# EAGLE design beacon1 (EAGLE 9.2.2)
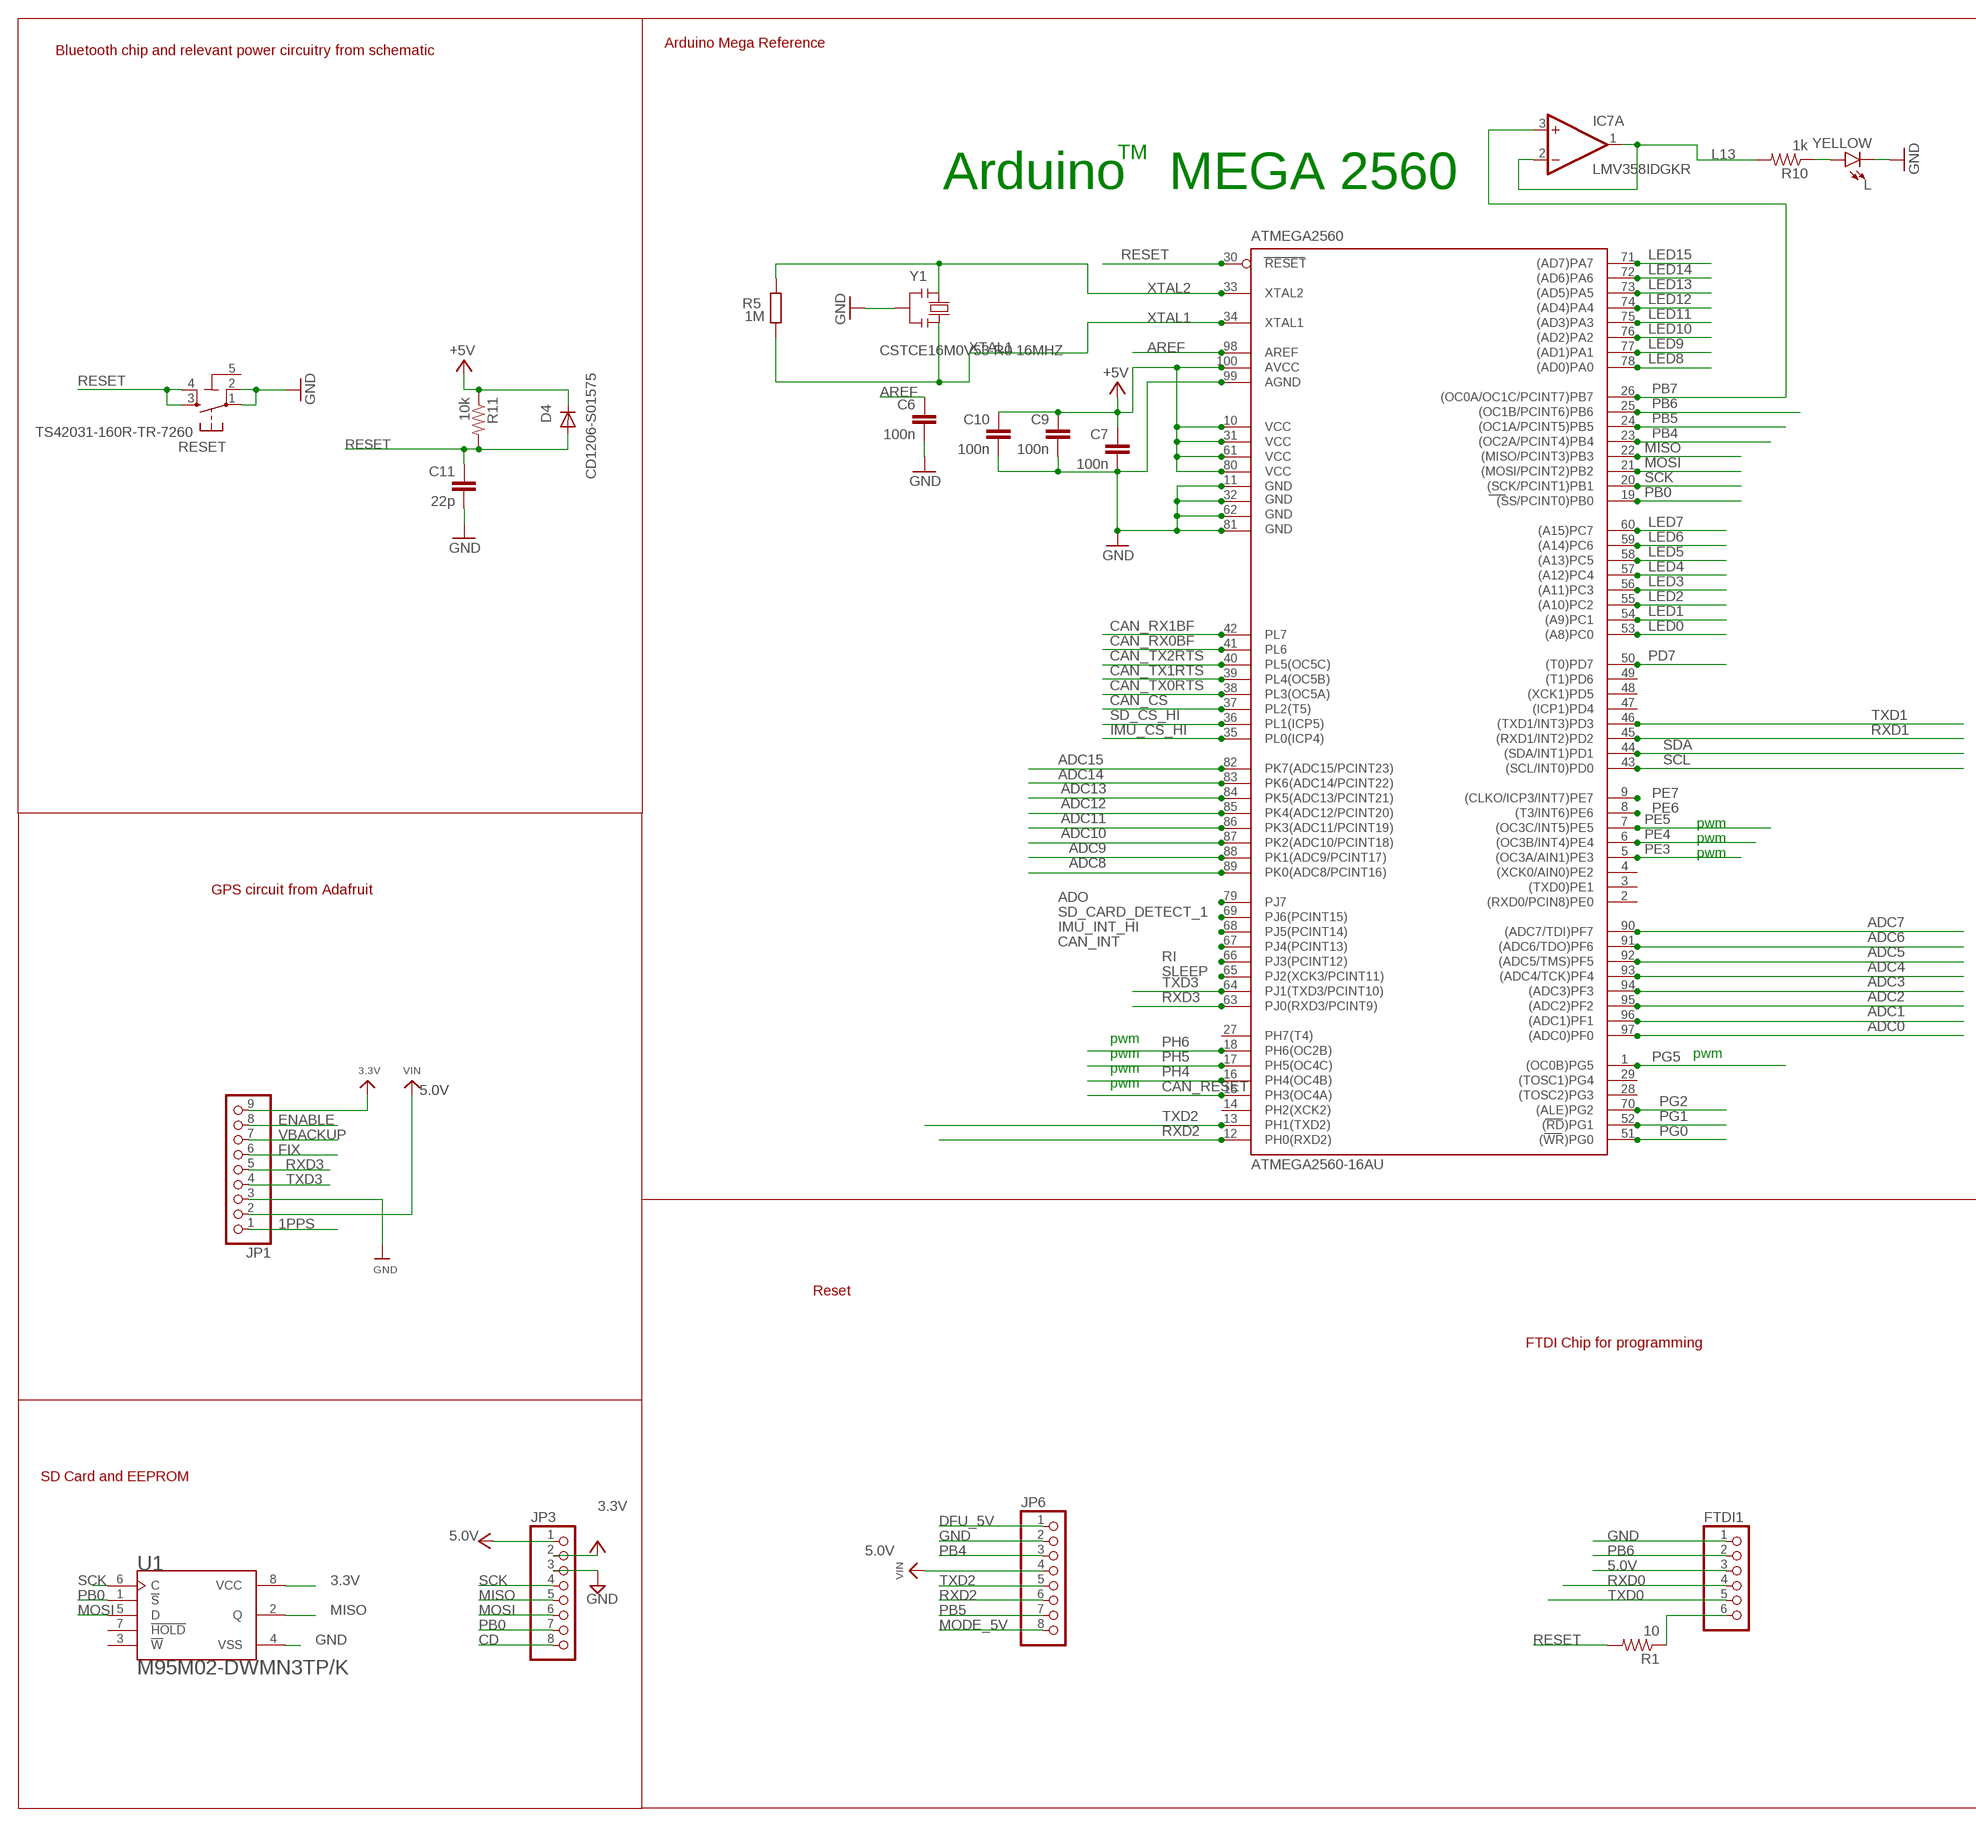
[diagram p0: schematic, sheet 1, part 1 of 2]
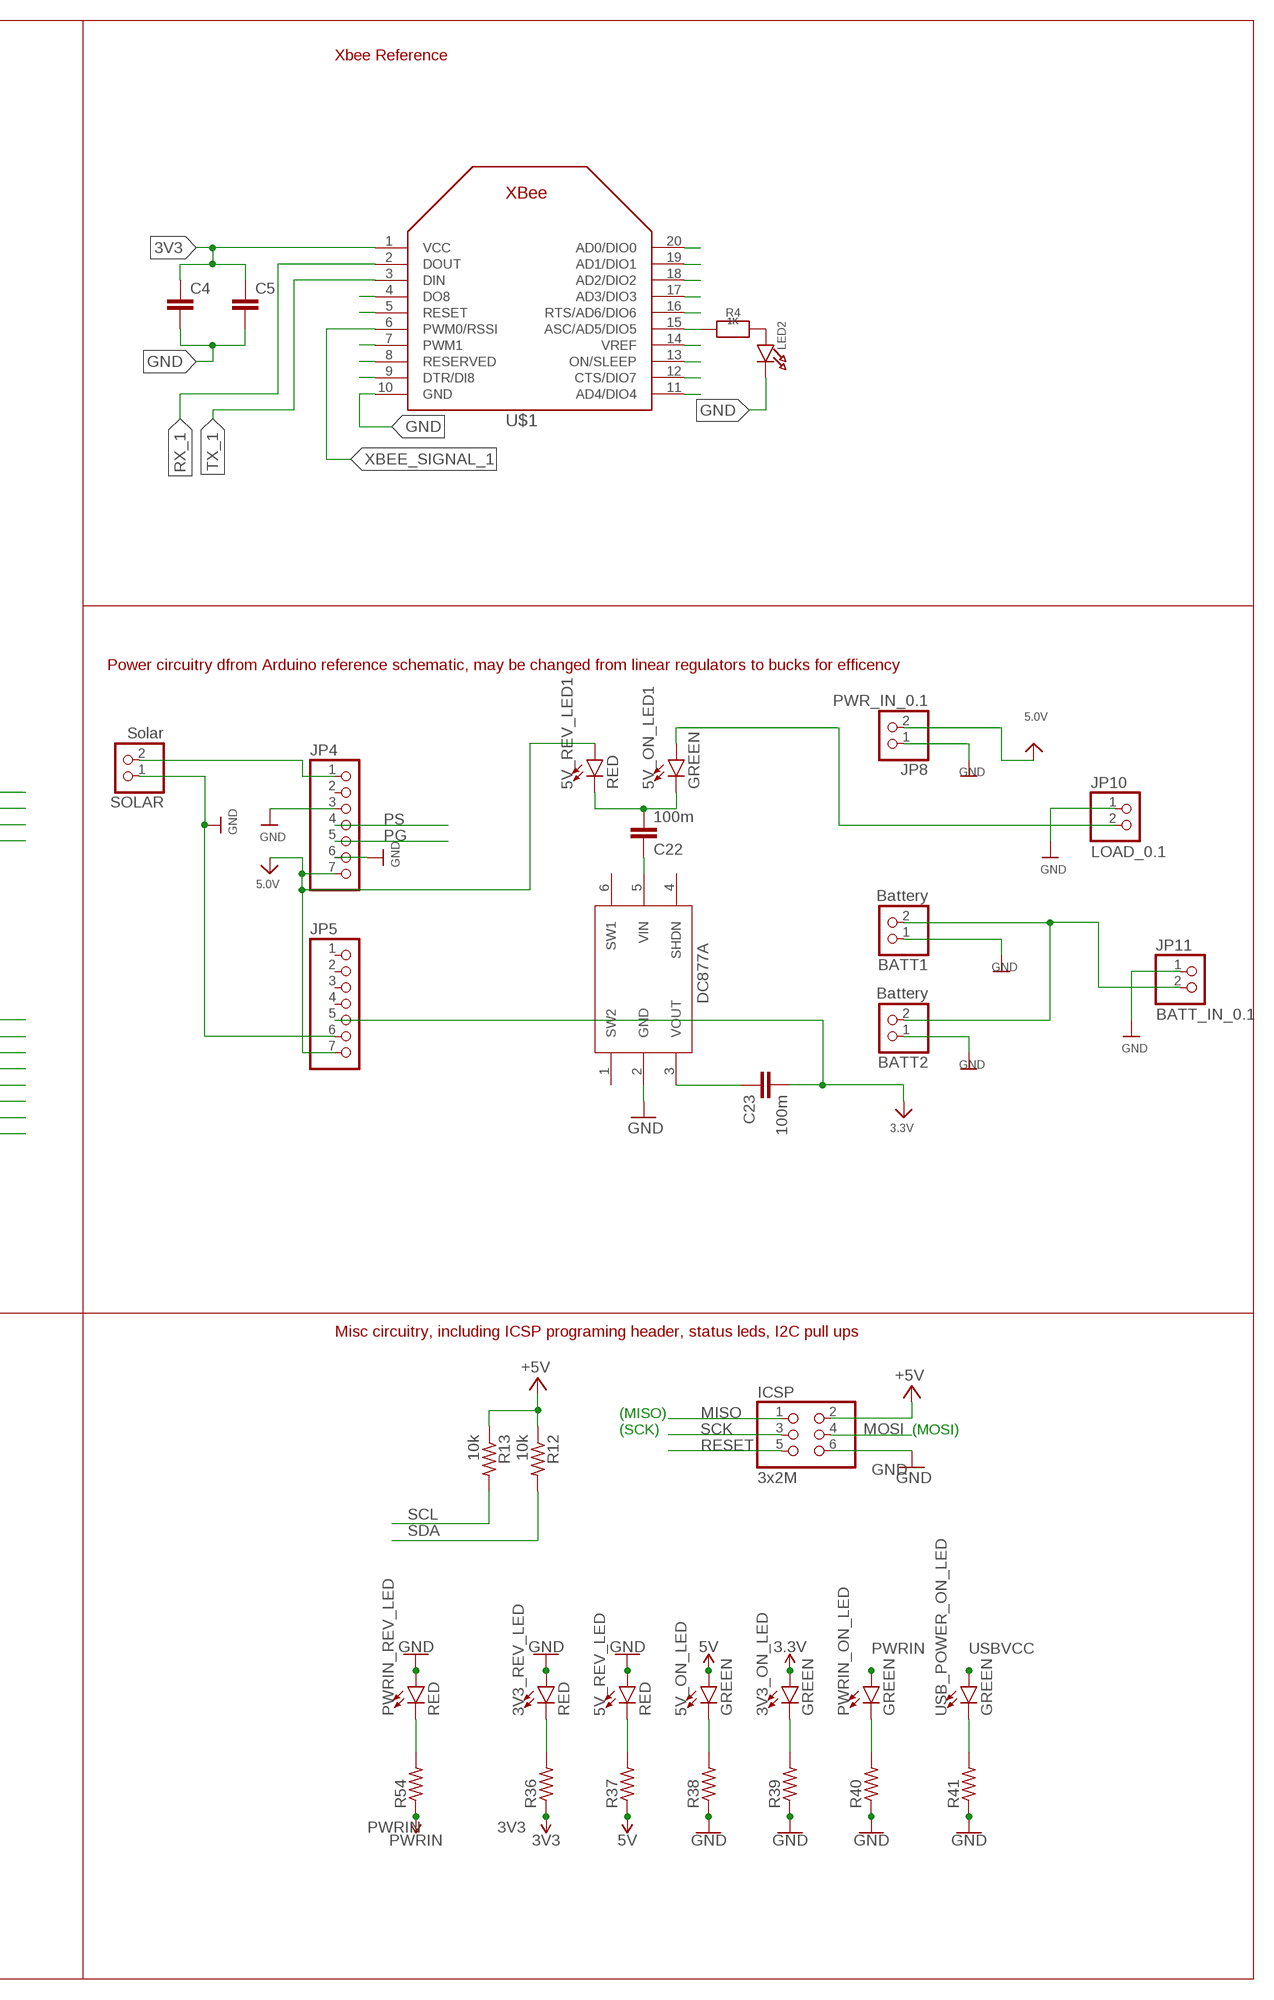
[diagram p1: schematic, sheet 1, part 2 of 2]

## Parts
3V3_ON_LED  GREEN  LED-GREENLILYPAD  [LED-1206]
3V3_REV_LED  RED  LED-RED1206  [LED-1206]
5V_ON_LED  GREEN  LED-GREENLILYPAD  [LED-1206]
5V_ON_LED1  GREEN  LED-GREENLILYPAD  [LED-1206]
5V_REV_LED  RED  LED-RED1206  [LED-1206]
5V_REV_LED1  RED  LED-RED1206  [LED-1206]
ATMEGA2560  ATMEGA2560-16AU  ATMEGA2560AU  [TQFP100]
BATT1  Battery  HEADER-1X2  [1X02_OVAL]
BATT2  Battery  HEADER-1X2  [1X02_OVAL]
C4  CC1206  [C1206]
C5  CC1206  [C1206]
C6  100n  C-EUC1206K  [C1206K]
C7  100n  C-EUC1206K  [C1206K]
C9  100n  C-EUC1206K  [C1206K]
C10  100n  C-EUC1206K  [C1206K]
C11  22p  C-EUC1206K  [C1206K]
C22  100m  C-EUC1206K  [C1206K]
C23  100m  C-EUC1206K  [C1206K]
D4  CD1206-S01575  DIODE-MINIMELF  [MINIMELF]
FTDI1  PINHD-1X6CB  [1X06-CLEANBIG]
IC7  LMV358IDGKR  LMV358MMX  [MSOP08]
ICSP  3x2M  PINHD-2X3  [2X03]
JP1  HEADER-1X970MIL  [1X09_ROUND_70]
JP3  PINHD-1X8BIG  [1X08-BIG]
JP4  HEADER-1X770MIL  [1X07_ROUND_70]
JP5  HEADER-1X770MIL  [1X07_ROUND_70]
JP6  HEADER-1X876MIL  [1X08_ROUND_76]
JP8  PWR_IN_0.1  HEADER-1X2  [1X02_OVAL]
JP10  LOAD_0.1  HEADER-1X2  [1X02_OVAL]
JP11  BATT_IN_0.1  HEADER-1X2  [1X02_OVAL]
L  YELLOW  LED1206  [LED-1206]
LED2  LED1206  [CHIPLED_1206]
PWRIN_ON_LED  GREEN  LED-GREENLILYPAD  [LED-1206]
PWRIN_REV_LED  RED  LED-RED1206  [LED-1206]
R1  10  R-US_R0805  [R0805]
R4  1K  RESISTOR0805_NOOUTLINE  [0805-NO]
R5  1M  R-EU_R1206  [R1206]
R10  1k  R-US_M1206  [M1206]
R11  10k  R-US_M1206  [M1206]
R12  10k  R-US_M1206  [M1206]
R13  10k  R-US_M1206  [M1206]
R36  R-US_M1206  [M1206]
R37  R-US_M1206  [M1206]
R38  R-US_M1206  [M1206]
R39  R-US_M1206  [M1206]
R40  R-US_M1206  [M1206]
R41  R-US_M1206  [M1206]
R54  R-US_M1206  [M1206]
RESET  TS42031-160R-TR-7260  TS42  [TS42]
SOLAR  Solar  HEADER-1X2  [1X02_OVAL]
U1  M95M02-DWMN3TP/K  [SOIC127P600X175-8N]
U$1  XBEE  [XBEE]
U$31  DC877A  [DC877A]
USB_POWER_ON_LED  GREEN  LED-GREENLILYPAD  [LED-1206]
Y1  CSTCE16M0V53-R0 16MHZ  RESONATORMU  [RESONATOR]

## Nets
1PPS: JP1.1
3.3V: C23.2 JP1.9 JP3.2 JP5.5 U1.8(VCC) ; supply symbol labelled +3V3
3V3 [power]: 3V3_ON_LED.A C4.1 C5.1 R36.1 U$1.1(VCC) ; supply symbol labelled 3.3V
5.0V: 5V_REV_LED1.A FTDI1.3 JP1.2 JP3.1 JP4.7 JP5.7 JP6.4 JP8.2 ; supply symbol labelled VCC, VIN
5V: 5V_ON_LED.A ATMEGA2560.10(VCC) ATMEGA2560.31(VCC1) ATMEGA2560.61(VCC2) ATMEGA2560.80(VCC3) ATMEGA2560.100(AVCC) C7.1 C9.1 C10.1 D4.C ICSP.2 R11.1 R12.1 R13.1 R37.1 ; supply symbol labelled +5V
90348 [gnd]: 3V3_REV_LED.A 5V_REV_LED.A ATMEGA2560.11(GND) ATMEGA2560.32(GND1) ATMEGA2560.62(GND2) ATMEGA2560.81(GND3) ATMEGA2560.99(AGND) C6.2 C7.2 C9.2 C10.2 C11.2 L.C PWRIN_REV_LED.A R38.1 R39.1 R40.1 R41.1 RESET.1 RESET.2 U$31.2(GND) Y1.2 ; supply symbol labelled GND
+5V2: BATT1.2 BATT2.2 JP11.2
ADC0: ATMEGA2560.97((ADC0)PF0)
ADC1: ATMEGA2560.96((ADC1)PF1)
ADC2: ATMEGA2560.95((ADC2)PF2)
ADC3: ATMEGA2560.94((ADC3)PF3)
ADC4: ATMEGA2560.93((ADC4/TCK)PF4)
ADC5: ATMEGA2560.92((ADC5/TMS)PF5)
ADC6: ATMEGA2560.91((ADC6/TDO)PF6)
ADC7: ATMEGA2560.90((ADC7/TDI)PF7)
ADC8: ATMEGA2560.89(PK0(ADC8/PCINT16))
ADC9: ATMEGA2560.88(PK1(ADC9/PCINT17))
ADC10: ATMEGA2560.87(PK2(ADC10/PCINT18))
ADC11: ATMEGA2560.86(PK3(ADC11/PCINT19))
ADC12: ATMEGA2560.85(PK4(ADC12/PCINT20))
ADC13: ATMEGA2560.84(PK5(ADC13/PCINT21))
ADC14: ATMEGA2560.83(PK6(ADC14/PCINT22))
ADC15: ATMEGA2560.82(PK7(ADC15/PCINT23))
ADO: ATMEGA2560.79(PJ7)
AREF: ATMEGA2560.98(AREF) C6.1
CAN_CS: ATMEGA2560.37(PL2(T5))
CAN_INT: ATMEGA2560.67(PJ4(PCINT13))
CAN_RESET: ATMEGA2560.15(PH3(OC4A))
CAN_RX0BF: ATMEGA2560.41(PL6)
CAN_RX1BF: ATMEGA2560.42(PL7)
CAN_TX0RTS: ATMEGA2560.38(PL3(OC5A))
CAN_TX1RTS: ATMEGA2560.39(PL4(OC5B))
CAN_TX2RTS: ATMEGA2560.40(PL5(OC5C))
CD: JP3.8
DFU_5V: JP6.1
ENABLE: JP1.8
FIX: JP1.6
GND: C4.2 C5.2 FTDI1.1 ICSP.6 JP1.3 JP3.3 JP4.3 JP4.6 JP5.6 JP6.2 JP8.1 JP10.1 JP11.1 LED2.C SOLAR.1 U1.4(VSS) U$1.10(GND)
GND2: BATT1.1
GND3: BATT2.1 ; supply symbol labelled GND
IMU_CS_HI: ATMEGA2560.35(PL0(ICP4))
IMU_INT_HI: ATMEGA2560.68(PJ5(PCINT14))
L13: IC7.1(A:OUT) IC7.2(A:-IN) R10.2
LED0: ATMEGA2560.53((A8)PC0)
LED1: ATMEGA2560.54((A9)PC1)
LED2: ATMEGA2560.55((A10)PC2)
LED3: ATMEGA2560.56((A11)PC3)
LED4: ATMEGA2560.57((A12)PC4)
LED5: ATMEGA2560.58((A13)PC5)
LED6: ATMEGA2560.59((A14)PC6)
LED7: ATMEGA2560.60((A15)PC7)
LED8: ATMEGA2560.78((AD0)PA0)
LED9: ATMEGA2560.77((AD1)PA1)
LED10: ATMEGA2560.76((AD2)PA2)
LED11: ATMEGA2560.75((AD3)PA3)
LED12: ATMEGA2560.74((AD4)PA4)
LED13: ATMEGA2560.73((AD5)PA5)
LED14: ATMEGA2560.72((AD6)PA6)
LED15: ATMEGA2560.71((AD7)PA7)
MISO: ATMEGA2560.22((MISO/PCINT3)PB3) ICSP.1 JP3.5 U1.2(Q)
MODE_5V: JP6.8
MOSI: ATMEGA2560.21((MOSI/PCINT2)PB2) ICSP.4 JP3.6 U1.5(D)
N$1: 5V_ON_LED1.A JP10.2
N$2: FTDI1.6 R1.1
N$3: JP4.1 SOLAR.2
N$6: LED2.A R4.2
N$7: L.A R10.1
N$13: PWRIN_ON_LED.C R40.2
N$14: R41.2 USB_POWER_ON_LED.C
N$20: PWRIN_REV_LED.C R54.2
N$22: C23.1 U$31.3(VOUT)
N$23: C22.1 U$31.5(VIN)
N$26: 5V_ON_LED1.C 5V_REV_LED1.C C22.2
N$37: 3V3_REV_LED.C R36.2
N$48: 5V_ON_LED.C R38.2
N$60: U$1.4(DO8)
N$61: U$1.5(RESET)
N$63: U$1.7(PWM1)
N$64: U$1.8(RESERVED)
N$65: U$1.9(DTR/DI8)
N$66: U$1.20(AD0/DIO0)
N$67: U$1.19(AD1/DIO1)
N$68: U$1.18(AD2/DIO2)
N$69: U$1.17(AD3/DIO3)
N$70: U$1.16(RTS/AD6/DIO6)
N$71: R4.1 U$1.15(ASC/AD5/DIO5)
N$72: U$1.14(VREF)
N$73: U$1.13(ON/SLEEP)
N$74: U$1.12(CTS/DIO7)
N$75: U$1.11(AD4/DIO4)
N$110: 5V_REV_LED.C R37.2
N$120: 3V3_ON_LED.C R39.2
PB0: ATMEGA2560.19((SS/PCINT0)PB0) JP3.7 U1.1(!S)
PB4: ATMEGA2560.23((OC2A/PCINT4)PB4) JP6.3
PB5: ATMEGA2560.24((OC1A/PCINT5)PB5) JP6.7
PB6: ATMEGA2560.25((OC1B/PCINT6)PB6) FTDI1.2
PB7: ATMEGA2560.26((OC0A/OC1C/PCINT7)PB7) IC7.3(A:+IN)
PD7: ATMEGA2560.50((T0)PD7)
PE3: ATMEGA2560.5((OC3A/AIN1)PE3)
PE4: ATMEGA2560.6((OC3B/INT4)PE4)
PE5: ATMEGA2560.7((OC3C/INT5)PE5)
PE6: ATMEGA2560.8((T3/INT6)PE6)
PE7: ATMEGA2560.9((CLKO/ICP3/INT7)PE7)
PG: JP4.5
PG0: ATMEGA2560.51((WR)PG0)
PG1: ATMEGA2560.52((RD)PG1)
PG2: ATMEGA2560.70((ALE)PG2)
PG5: ATMEGA2560.1((OC0B)PG5)
PH4: ATMEGA2560.16(PH4(OC4B))
PH5: ATMEGA2560.17(PH5(OC4C))
PH6: ATMEGA2560.18(PH6(OC2B))
PS: JP4.4
PWRIN [power]: PWRIN_ON_LED.A R54.1
RESET: ATMEGA2560.30(RESET) C11.1 D4.A ICSP.5 R1.2 R11.2 RESET.3 RESET.4
RI: ATMEGA2560.66(PJ3(PCINT12))
RX_1: U$1.2(DOUT)
RXD0: FTDI1.4
RXD1: ATMEGA2560.45((RXD1/INT2)PD2)
RXD2: ATMEGA2560.12(PH0(RXD2)) JP6.6
RXD3: ATMEGA2560.63(PJ0(RXD3/PCINT9)) JP1.5
SCK: ATMEGA2560.20((SCK/PCINT1)PB1) ICSP.3 JP3.4 U1.6(C)
SCL: ATMEGA2560.43((SCL/INT0)PD0) R13.2
SD_CARD_DETECT_1: ATMEGA2560.69(PJ6(PCINT15))
SD_CS_HI: ATMEGA2560.36(PL1(ICP5))
SDA: ATMEGA2560.44((SDA/INT1)PD1) R12.2
SLEEP: ATMEGA2560.65(PJ2(XCK3/PCINT11))
TX_1: U$1.3(DIN)
TXD0: FTDI1.5
TXD1: ATMEGA2560.46((TXD1/INT3)PD3)
TXD2: ATMEGA2560.13(PH1(TXD2)) JP6.5
TXD3: ATMEGA2560.64(PJ1(TXD3/PCINT10)) JP1.4
USBVCC [power usb]: USB_POWER_ON_LED.A
VBACKUP: JP1.7
XBEE_SIGNAL_1: U$1.6(PWM0/RSSI)
XTAL1: ATMEGA2560.34(XTAL1) R5.1 Y1.3
XTAL2: ATMEGA2560.33(XTAL2) R5.2 Y1.1
Unconnected: ATMEGA2560.2((RXD0/PCIN8)PE0) ATMEGA2560.3((TXD0)PE1) ATMEGA2560.4((XCK0/AIN0)PE2) ATMEGA2560.14(PH2(XCK2)) ATMEGA2560.27(PH7(T4)) ATMEGA2560.28((TOSC2)PG3) ATMEGA2560.29((TOSC1)PG4) ATMEGA2560.47((ICP1)PD4) ATMEGA2560.48((XCK1)PD5) ATMEGA2560.49((T1)PD6) IC7.5(B:+IN) IC7.6(B:-IN) IC7.7(B:OUT) JP4.2 JP5.1 JP5.2 JP5.3 JP5.4 U1.3(!W) U1.7(!HOLD) U$31.1(SW2) U$31.4(SHDN) U$31.6(SW1)

## Notes on the sheet
- Arduino Mega Reference
- Bluetooth chip and relevant power circuitry from schematic | Xbee Reference
- TM
- Arduino   MEGA 2560
- Power circuitry dfrom Arduino reference schematic, may be changed from linear regulators to bucks for efficency
- pwm
- pwm
- pwm
- GPS circuit from Adafruit
- pwm
- pwm | pwm
- pwm
- pwm
- Misc circuitry, including ICSP programing header, status leds, I2C pull ups
- Reset | (MISO)
- (SCK) | (MOSI)
- FTDI Chip for programming
- SD Card and EEPROM

## Power pins joined to a net without a drawn wire
5-GND: RESET.5(5-GND)
V+: IC7.8(P:V+)
V-: IC7.4(P:V-)

## Library data of the parts
3V3_ON_LED 5V_ON_LED 5V_ON_LED1 PWRIN_ON_LED USB_POWER_ON_LED = SparkFun-LED:LED-GREEN: Green SMD LED Used in manufacturing of various products at SparkFun Packages: 0603 - SMD 0603 package [Product Link] <http://www.futureelectronics.com/en/technologies/semiconductors/optoelectronics/leds/Pages/9894312-LTST-C190GKT.aspx?CrossPart=HSMG-C190&IM=0> LilyPad 1206 - SMD1206 LilyPad package [Product Link] <http://www.futureelectronics.com/en/Technologies/Product.aspx?ProductID=IN150NGHARVATEKCORPORATION2049943&IM=0> 1206 - SMD1206 package [Product Link] <http://www.futureelectronics.com/en/technologies/semiconductors/optoelectronics/leds/Pages/8315665-LTST-C150KGKT.aspx?IM=0> 1206 Bottom Mount -SMD 1206 Bottom Mount [Product Link] <http://www.digikey.com/product-detail/en/lite-on-inc/LTST-C230KGKT/160-1456-1-ND/386854> SparkFun Products: Pro Mini 328 -5V <https://www.sparkfun.com/products/821> RedBoard <https://www.sparkfun.com/products/12757> MP3 Trigger <https://www.sparkfun.com/products/13720> Makey Makey <https://www.sparkfun.com/products/11076>; PROD_ID: DIO-09910
3V3_REV_LED 5V_REV_LED 5V_REV_LED1 PWRIN_REV_LED = SparkFun-LED:LED-RED: Red SMD LED Used in manufacturing of most products at SparkFun Packages: 0603 - SMD 0603 package [Product Link] <http://docs.avagotech.com/docs/AV02-0551EN> 0603 SMART - SMD 0603 SMART package ( more efficient and expensive)[Product Link] <http://www.osram-os.com/Graphics/XPic2/00077099_0.pdf> 1206 - SMD1206 package [Product Link] <https://www.sparkfun.com/datasheets/DevTools/LilyPad/Q150OVS4.pdff> SparkFun Products: Pro Mini 328 -5V <https://www.sparkfun.com/products/821> RedBoard <https://www.sparkfun.com/products/12757> IOIO-OTG <https://www.sparkfun.com/products/13613>; PROD_ID: DIO-09912
ATMEGA2560 = SparkFun-DigitalIC:ATMEGA2560: Atmel 100-pin 8-bit uC 64/128/256 Kbytes FLASH 4 Kbytes EEPROM 8 Kbytes SRAM 86 General Purpose I/O pins 12-channels16-bit PWM 4 x Serial USARTs 16-channels 10-bit A/D
BATT1 BATT2 JP8 JP10 JP11 SOLAR = microbuilder:HEADER-1X2: PIN HEADER
C4 C5 = eagle-ltspice:C: CAPACITOR, European symbol; SPICEMODEL: NONE; SPICEPREFIX: C
C6 C7 C9-C11 C22 C23 = SmartPrj:C-EU: CAPACITOR, European symbol
D4 = diode:DIODE-: DIODE
FTDI1 = adafruit:PINHD-1X6: PIN HEADER
IC7 = linear:LMV358?*: Dual General Purpose, Low Voltage, Rail-to-Rail Output Operational Amplifiers Source: http://www.national.com/mpf/LM/LMV321.html http://www.national.com/dt/lmv_qual.pdf
ICSP = SmartPrj:PINHD-2X3: PIN HEADER
JP1 = microbuilder:HEADER-1X9: PIN HEADER
JP3 = adafruit:PINHD-1X8: PIN HEADER
JP4 JP5 = microbuilder:HEADER-1X7: PIN HEADER
JP6 = microbuilder:HEADER-1X8: PIN HEADER
L = SparkFun-LED:LED: LED (Generic) Standard schematic elements and footprints for 5mm, 3mm, 1206, and 0603 sized LEDs. Generic LEDs with no color specified.
LED2 = microbuilder:LED: LED 0603 - 0603 Surface Mount Package 2mA: Green LED - Low Power (3.9mcd, 2ma, 1.7Vf) - Digikey: 475-2709-2-ND Orange LED - Low Power (9.8mcd, 2ma, 1.8Vf) - Digikey: 475-1194-2-ND Red LED - Low Power (5mcd, 2ma, 1.8Vf) - Digikey: 475-1195-2-ND Yellow LED - Low Power (7mcd, 2ma, 1.8Vf) - Digikey: 475-1196-2-ND 5mA: Blue LED - Low Power (17mcd, 5ma, 2.9Vf) - Digikey: LNJ937W8CRACT-ND 0805 - 0805 Surface Mount Package 2mA: Red LED (8.8mcd, 2mA, 1.8Vf, Clear) - Low Power [Digikey: 475-2510-1-ND] Green LED (5mcd, 2mA, 1.8Vf, Clear) - Low Power [Digikey: 475-2730-1-ND] Yellow LED (11.3mcd, 2mA, 1.8Vf, Clear) - Low Power [Digikey: 475-2555-1-ND] 20mA: Red LED (104mcd, 20mA, Diffused) - LS R976 [Digikey: 475-1278-6-ND] Red LED (12mcd, 20mA, 2.0Vf, Clear) - APT2012EC [Digikey: 754-1128-1-ND] Green LED (15mcd, 20mA, 2.2Vf, Clear) - APT2012GC [Digikey: 754-1131-1-ND] Orange LED (160mcd, 20mA, 2.1Vf, Clear) - APT2012SECK [Digikey: 754-1130-1-ND] 1206 - 1206 Surface Mount Package Green LED (26mcd, 20mA, Diffused) - LG N971 [Digikey: 475-1407-6-ND] Red LED (15mcd, 20mA, Diffused) - LH N974 [Digikey: 475-1416-6-ND] Cree - Cree High-Power Surface Mount LEDs XPEBWT-L1-0000-00D50 - White 111lm 350mA 2.9Vf 6200K 110° XTEAWT-00-0000-00000LEE3 - White 114lm 350mA 2.85Vf 5000K 115° Everlight - Everlight 45-21 Series Surface Mount LEDs 45-21/QK2C-B2832AC2CB2/2T - Warm White 2000mcd 20mA 3.25Vf 3050K 120° 45-21/LK2C-B38452C4CB2/2T - Nuetral White 2000mcd 20mA 3.25Vf 4150K 120° 45-21/LK2C-B50634C6CB2/2T - Cold White 2200mcd 20mA 3.25Vf 5650K 120° PLCC2 Reverse Mount LS T77K-J1L2-1-0-2-R18-Z - Red 11.25mcd 2mA 1.8Vf 630nm 120° LO T77K-L1M2-24-Z - Orange 19.6mcd 2mA 1.8Vf 606nm 120° LY T77K-K2M1-26-Z - Yellow 15.7mcd 2mA 1.8Vf 587nm 120°
R1 R10-R13 = adafruit:R-US_: RESISTOR, American symbol
R4 = microbuilder:RESISTOR: Resistors For new designs, use the packages preceded by an '_' character since they are more reliable: The following footprints should be used on most boards: _0402 - Standard footprint for regular board layouts _0603 - Standard footprint for regular board layouts _0805 - Standard footprint for regular board layouts _1206 - Standard footprint for regular board layouts For extremely tight-pitch boards where space is at a premium, the following 'micro-pitch' footprints can be used (smaller pads, no silkscreen outline, etc.): _0402MP - Micro-pitch footprint for very dense/compact boards _0603MP - Micro-pitch footprint for very dense/compact boards _0805MP - Micro-pitch footprint for very dense/compact boards _1206MP - Micro-pitch footprint for very dense/compact boards
R5 = SmartPrj:R-EU_: RESISTOR, European symbol
R36-R41 R54 = resistor:R-US_: RESISTOR, American symbol
RESET = SmartPrj:TS42: TS42 Dongnan Electronics Tact switch VDC 12V - 50mA
U1 = M95M02-DWMN3TP_K:M95M02-DWMN3TP/K: EEPROM Serial-SPI 2M-bit 256K x 8 3.3V/5V Automotive 8-Pin SO N T/R; DESCRIPTION: EEPROM Serial-SPI 2M-bit 256K x 8 3.3V/5V Automotive 8-Pin SO N T/R; DIGI-KEY_PART_NUMBER: 497-15597-1-ND; DIGI-KEY_PURCHASE_URL: https://www.digikey.com/product-detail/en/stmicroelectronics/M95M02-DWMN3TP-K/497-15597-1-ND/5250474?utm_source=snapeda&utm_medium=aggregator&utm_campaign=symbol; MF: STMicroelectronics; MP: M95M02-DWMN3TP/K; PACKAGE: SO-8 STMicroelectronics
U$1 = adafruit:XBEE
U$31 = DC877A:DC877A
Y1 = SmartPrj:RESONATOR

## Net classes
1 power: width 0.61 mm, drill 0.406 mm, clearance 0.203 mm
2 gnd: width 0.305 mm, drill 0.406 mm, clearance 0.203 mm
3 power usb: width 0.508 mm, drill 0.406 mm, clearance 0.203 mm

## Board
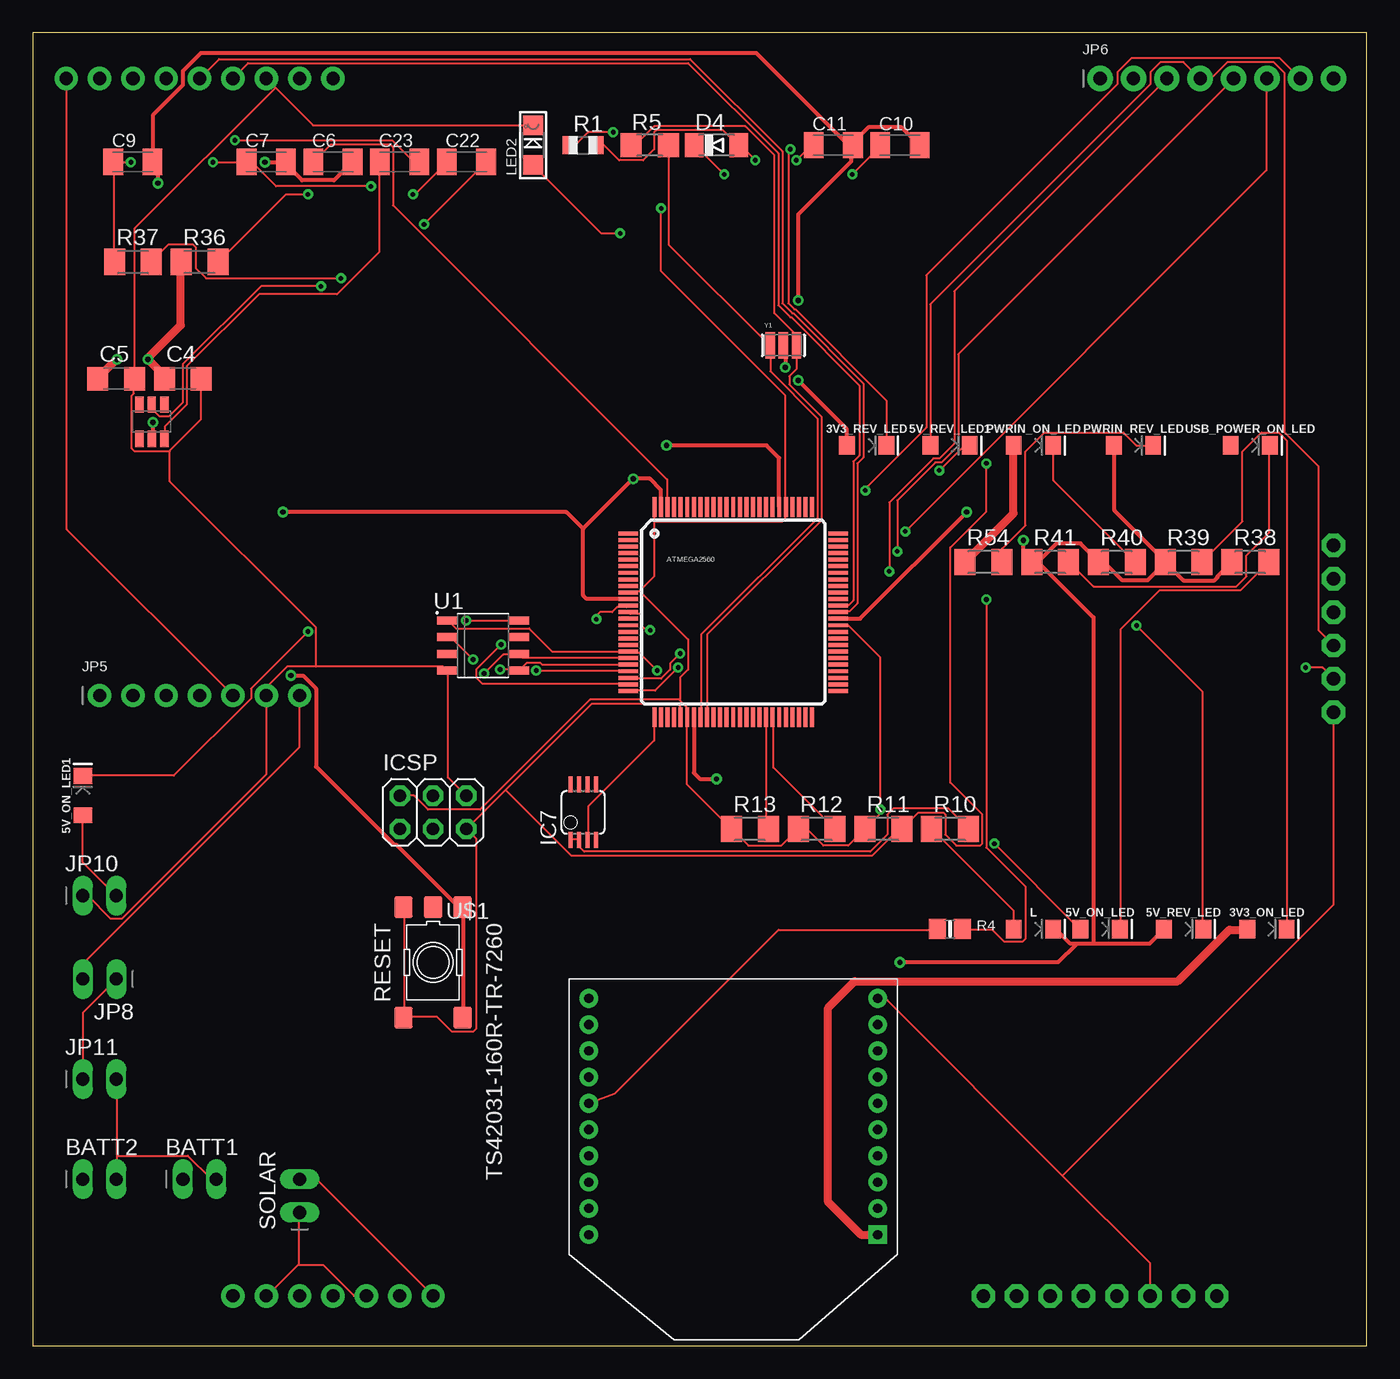
[diagram p2: board, top side]
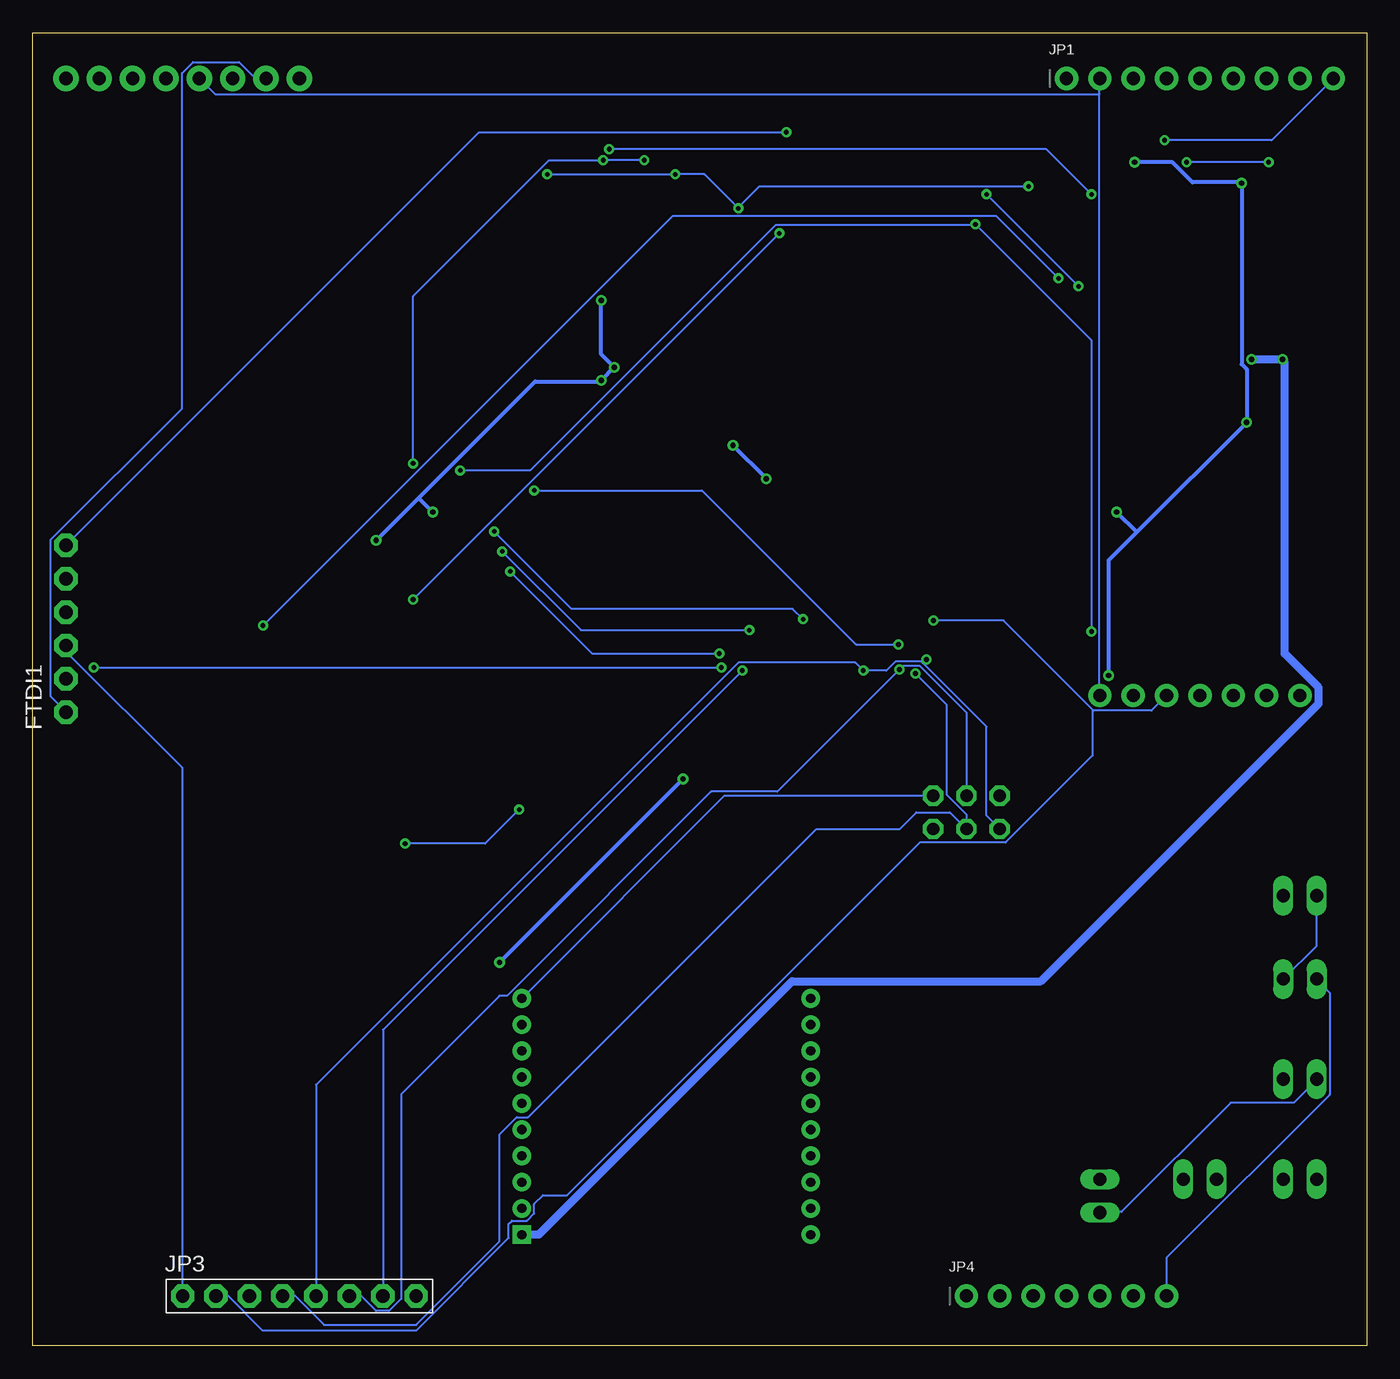
[diagram p3: board, bottom side, seen from below]

Size 101.58 x 100 mm. Coordinates in mm from the lower left corner, seen from the top.
Outline: 0,0 101.58,0 101.58,100 0,100 0,0
Copper layers (1*16): Top 0.035mm / dielectric 1.5mm / Bottom 0.035mm
Design rules "default": minimum track width 6mil, minimum drill 0.35mm, track to track 6mil, track to pad 6mil, pad to pad 6mil, via to via 6mil, smd to smd 6mil, copper to edge 40mil, drill to drill 6mil, minimum pad ring 10mil, minimum via ring 8mil, stop-mask expansion 4mil, vias tented up to drill 0mil, thermal gap 10mil

### Footprints (pad centres in the part's own frame; a part is rotated, then mirrored left to right if it is on the bottom)
LED-1206 = smd 1.2 x 1.4: A -1.5,0; C 1.5,0
TQFP100 = smd 1.5 x 0.3: 1 -8,6; 2 -8,5.5; 3 -8,5; 4 -8,4.5; 5 -8,4; 6 -8,3.5; 7 -8,3; 8 -8,2.5; 9 -8,2; 10 -8,1.5; 11 -8,1; 12 -8,0.5; 13 -8,0; 14 -8,-0.5; 15 -8,-1; 16 -8,-1.5; 17 -8,-2; 18 -8,-2.5; 19 -8,-3; 20 -8,-3.5; 21 -8,-4; 22 -8,-4.5; 23 -8,-5; 24 -8,-5.5; 25 -8,-6; 51 8,-6; 52 8,-5.5; 53 8,-5; 54 8,-4.5; 55 8,-4; 56 8,-3.5; 57 8,-3; 58 8,-2.5; 59 8,-2; 60 8,-1.5; 61 8,-1; 62 8,-0.5; 63 8,0; 64 8,0.5; 65 8,1; 66 8,1.5; 67 8,2; 68 8,2.5; 69 8,3; 70 8,3.5; 71 8,4; 72 8,4.5; 73 8,5; 74 8,5.5; 75 8,6 | smd 0.3 x 1.5: 26 -6,-8; 27 -5.5,-8; 28 -5,-8; 29 -4.5,-8; 30 -4,-8; 31 -3.5,-8; 32 -3,-8; 33 -2.5,-8; 34 -2,-8; 35 -1.5,-8; 36 -1,-8; 37 -0.5,-8; 38 0,-8; 39 0.5,-8; 40 1,-8; 41 1.5,-8; 42 2,-8; 43 2.5,-8; 44 3,-8; 45 3.5,-8; 46 4,-8; 47 4.5,-8; 48 5,-8; 49 5.5,-8; 50 6,-8; 76 6,8; 77 5.5,8; 78 5,8; 79 4.5,8; 80 4,8; 81 3.5,8; 82 3,8; 83 2.5,8; 84 2,8; 85 1.5,8; 86 1,8; 87 0.5,8; 88 0,8; 89 -0.5,8; 90 -1,8; 91 -1.5,8; 92 -2,8; 93 -2.5,8; 94 -3,8; 95 -3.5,8; 96 -4,8; 97 -4.5,8; 98 -5,8; 99 -5.5,8; 100 -6,8
1X02_OVAL = drill 1 long: 1 -1.27,0; 2 1.27,0
C1206 = smd 1.6 x 1.8: 1 -1.4,0; 2 1.4,0
C1206K = smd 1.5 x 2: 1 -1.5,0; 2 1.5,0
MINIMELF = smd 1.4 x 1.8: A 1.7,0; C -1.7,0
1X06-CLEANBIG = drill 1.016 pad 1.778 octagon: 1 -6.35,0; 2 -3.81,0; 3 -1.27,0; 4 1.27,0; 5 3.81,0; 6 6.35,0
MSOP08 = smd 0.3 x 1.2: 1 -0.976,-2.113; 2 -0.326,-2.113; 3 0.324,-2.113; 4 0.974,-2.113; 5 0.974,2.112; 6 0.324,2.112; 7 -0.326,2.112; 8 -0.976,2.112
2X03 = drill 0.95 pad 1.55 octagon: 1 -2.54,-1.27; 2 -2.54,1.27; 3 0,-1.27; 4 0,1.27; 5 2.54,-1.27; 6 2.54,1.27
1X09_ROUND_70 = drill 1 pad 1.778: 1 -10.16,0; 2 -7.62,0; 3 -5.08,0; 4 -2.54,0; 5 0,0; 6 2.54,0; 7 5.08,0; 8 7.62,0; 9 10.16,0
1X08-BIG = drill 1.016 pad 1.778 octagon: 1 -8.89,0; 2 -6.35,0; 3 -3.81,0; 4 -1.27,0; 5 1.27,0; 6 3.81,0; 7 6.35,0; 8 8.89,0
1X07_ROUND_70 = drill 1 pad 1.778: 1 -7.62,0; 2 -5.08,0; 3 -2.54,0; 4 0,0; 5 2.54,0; 6 5.08,0; 7 7.62,0
1X08_ROUND_76 = drill 1 pad 1.93: 1 -8.89,0; 2 -6.35,0; 3 -3.81,0; 4 -1.27,0; 5 1.27,0; 6 3.81,0; 7 6.35,0; 8 8.89,0
CHIPLED_1206 = smd 1.5 x 1.5: A 0,-1.496; C 0,1.496
R0805 = smd 1.1 x 1.4: 1 -1,0; 2 1,0
0805-NO = smd 1.3 x 1.5: 1 -0.95,0; 2 0.95,0
R1206 = smd 1.6 x 1.803: 1 -1.422,0; 2 1.422,0
M1206 = smd 1.6 x 2: 1 -1.4,0; 2 1.4,0
TS42 = smd 1.6 x 1.4: 1 -4.2,2.25; 2 4.2,2.25; 3 -4.2,-2.25; 4 4.2,-2.25; 5 -4.2,0
SOIC127P600X175-8N = smd 1.6 x 0.6: 1 -2.7,1.905; 2 -2.7,0.635; 3 -2.7,-0.635; 4 -2.7,-1.905; 5 2.7,-1.905; 6 2.7,-0.635; 7 2.7,0.635; 8 2.7,1.905
XBEE = drill 0.7 pad 1.422 square: 1 -11,5.5 | drill 0.7 pad 1.422: 2 -11,3.5; 3 -11,1.5; 4 -11,-0.5; 5 -11,-2.5; 6 -11,-4.5; 7 -11,-6.5; 8 -11,-8.5; 9 -11,-10.5; 10 -11,-12.5; 11 11,-12.5; 12 11,-10.5; 13 11,-8.5; 14 11,-6.5; 15 11,-4.5; 16 11,-2.5; 17 11,-0.5; 18 11,1.5; 19 11,3.5; 20 11,5.5
DC877A = smd 0.62 x 1.22: 1 0.5,0.5; 2 1.45,0.5; 3 2.4,0.5; 4 2.4,3.12; 5 1.425,3.12; 6 0.5,3.12
RESONATOR = smd 0.7 x 2: 1 -1,0; 2 0,0; 3 1,0

### Placement (x,y rotation side)
3V3_ON_LED  93.98,31.75 0 top
3V3_REV_LED  63.5,68.58 0 top
5V_ON_LED  81.28,31.75 0 top
5V_ON_LED1  3.81,41.91 90 top
5V_REV_LED  87.63,31.75 0 top
5V_REV_LED1  69.85,68.58 0 top
ATMEGA2560  53.34,55.88 0 top
BATT1  12.7,12.7 0 top
BATT2  5.08,12.7 0 top
C4  11.43,73.66 0 top
C5  6.35,73.66 0 top
C6  22.86,90.17 0 top
C7  17.78,90.17 0 top
C9  7.62,90.17 0 top
C10  66.04,91.44 0 top
C11  60.96,91.44 0 top
C22  33.02,90.17 0 top
C23  27.94,90.17 0 top
D4  52.07,91.44 0 top
FTDI1  99.06,54.61 90 bottom
IC7  41.91,40.64 0 top
ICSP  30.48,40.64 0 top
JP1  12.7,96.52 0 bottom
JP3  81.28,3.81 0 bottom
JP4  22.86,3.81 0 bottom
JP5  12.7,49.53 0 top
JP6  90.17,96.52 0 top
JP8  5.08,27.94 180 top
JP10  5.08,34.29 0 top
JP11  5.08,20.32 0 top
L  76.2,31.75 0 top
LED2  38.1,91.44 0 top
PWRIN_ON_LED  76.2,68.58 0 top
PWRIN_REV_LED  83.82,68.58 0 top
R1  41.91,91.44 0 top
R4  69.85,31.75 0 top
R5  46.99,91.44 0 top
R10  69.85,39.37 0 top
R11  64.77,39.37 0 top
R12  59.69,39.37 0 top
R13  54.61,39.37 0 top
R36  12.7,82.55 0 top
R37  7.62,82.55 0 top
R38  92.71,59.69 0 top
R39  87.63,59.69 0 top
R40  82.55,59.69 0 top
R41  77.47,59.69 0 top
R54  72.39,59.69 0 top
RESET  30.48,29.21 270 top
SOLAR  20.32,11.43 90 top
U1  34.29,53.34 0 top
U$1  53.34,13.97 180 top
U$31  7.62,68.58 0 top
USB_POWER_ON_LED  92.71,68.58 0 top
Y1  57.15,76.2 0 top

### Tracks (layer width: path | path; a pad name or v marks a point on that pad's centre or on a via)
3.3V  (via drill 0.35)
  Top 0.152: v15.39,91.82 27.36,91.82 28.96,90.22 29.41,90.22 C23.2 | v32.99,55.24 U1.8 | JP5.5 2.59,62.18 2.59,96.47 JP1.9
  Bottom 0.152: v15.39,91.82 7.24,91.82 JP1.9 | v32.99,55.24 27.66,55.24 20.84,48.42 | 20.84,48.42 20.8,48.39 16.38,48.39 JP5.5 | JP3.2 86.72,3.81 84.07,1.17 72.39,1.17 65.33,8.23 65.33,9.3 65.1,9.53 63.95,9.53 63.4,10.08 63.4,10.82 62.74,11.48 60.88,11.48 34.04,38.33 27.51,38.33 20.88,44.96 20.88,48.39 20.84,48.42
3V3  (via drill 0.41)
  Top 0.61: v6.4,75.13 4.95,73.69 C5.1 | C4.1 9.98,73.69 9.98,73.91 v8.76,75.13 8.91,75.36 11.28,77.72 11.28,82.53 R36.1 | 3V3_ON_LED.A 92.43,31.7 91.14,31.7 87.2,27.76 62.59,27.76 60.55,25.73 60.55,10.97 63.06,8.47 U$1.1
  Bottom 0.61: v8.76,75.13 v6.4,75.13 6.25,74.91 6.25,52.73 3.66,50.14 3.66,48.92 24.82,27.76 43.76,27.76 63.04,8.48 63.07,8.47 U$1.1
5.0V
  Top 0.152: JP8.2 3.81,29.11 20.27,45.57 20.27,49.53 JP5.7 | 5V_REV_LED1.A 68.35,79.32 85.11,96.09 85.11,97 85.88,97.77 87.63,97.77 88.85,96.55 JP6.4 88.92,96.55 89.76,96.55 90.98,97.77 94.49,97.77 95.33,96.93 95.33,69.57 97.92,66.98 97.92,54.48 FTDI1.3
  Bottom 0.152: JP4.7 15.24,6.71 2.82,19.13 2.82,26.9 3.81,27.89 JP8.2 | 20.34,95.33 20.34,49.53 JP5.7 | 20.34,95.33 20.34,96.47 JP1.2 | FTDI1.3 99.06,52.88 90.22,44.04 90.22,3.81 JP3.1 | 20.34,95.33 87.71,95.33 JP6.4
5V  (via drill 0.35)
  Top 0.152: ICSP.2 29.03,41.91 30.1,40.84 34.06,40.84 42.44,49.23 49.23,49.23 49.26,49.19 | 49.26,49.19 49.84,48.62 49.84,47.93 ATMEGA2560.31 49.84,47.85 49.84,42.75 53.19,39.4 R13.1 53.26,39.32 54.48,38.1 57,38.1 58.22,39.32 R12.1 58.29,39.32 58.98,39.32 60.2,38.1 62.1,38.1 63.32,39.32 R11.1 63.4,39.4 64.54,40.54 v64.54,40.84 64.54,52.43 62.1,54.86 61.34,54.86 ATMEGA2560.61 | v73.23,38.25 79.7,31.77 5V_ON_LED.A | R37.1 6.17,82.6 6.17,90.14 C9.1 6.25,90.14 v7.47,90.14 | v13.72,90.14 16.23,90.14 C7.1 16.31,90.14 16.69,90.14 18.52,88.32 v25.76,88.32 | v52.65,89.23 50.44,91.44 D4.C | v62.41,89.23 64.47,91.29 64.47,91.44 C10.1 | 46.22,57.49 47.32,58.6 47.32,62.79 | 46.22,57.49 46.18,57.45 45.41,57.45 ATMEGA2560.10 | 47.32,62.79 47.32,63.86 ATMEGA2560.100 | 47.32,62.79 57.07,62.79 57.3,63.02 57.3,63.86 ATMEGA2560.80 57.3,63.93 57.3,72.39 47.85,81.84 v47.85,86.64 | 46.22,57.49 49.91,53.8 49.91,51.51 49.3,50.9 49.3,49.23 49.26,49.19
  Bottom 0.152: v73.23,38.25 67.13,38.25 v64.54,40.84 | v7.47,90.14 v13.72,90.14 | v62.41,89.23 v52.65,89.23 50.44,89.23 v47.85,86.64 47.85,86.72 46.25,88.32 v25.76,88.32
90348  (via drill 0.41)
  Top 0.305: RESET.2 32.77,25.07 32.77,33.38 RESET.1 32.61,33.45 32.38,33.45 27.66,38.18 27.51,38.18 21.57,44.12 21.57,50.06 20.57,51.05 v19.66,51.05 | C6.2 24.31,90.14 22.94,88.77 20.5,88.77 19.36,89.92 19.36,90.14 C7.2 19.13,90.14 v17.68,90.14 | v9.14,70.33 9.14,69.11 U$31.2 | v9.53,88.54 9.53,89.76 9.14,90.14 C9.2 9.14,90.3 9.14,93.73 11.43,96.01 11.43,97.08 12.8,98.45 55.09,98.45 62.18,91.36 C11.2 | C11.2 62.48,91.44 62.48,91.67 63.63,92.81 66.14,92.81 67.51,91.44 C10.2 | v58.29,73.53 61.95,69.88 61.95,68.58 3V3_REV_LED.A | v57.3,74.52 57.3,76.05 Y1.2 | v58.29,79.63 58.29,86.18 62.33,90.22 62.33,91.36 C11.2 | 80.77,30.63 85.04,30.63 86.11,31.7 5V_REV_LED.A | 80.77,30.63 79.5,30.63 | 79.5,30.63 79.02,30.63 77.95,31.7 77.72,31.7 L.C | R41.1 76.12,59.74 76.58,59.74 77.95,61.11 79.78,61.11 81.15,59.74 R40.1 81.31,59.74 81.53,59.74 82.98,58.29 84.89,58.29 86.18,59.59 R39.1 | PWRIN_REV_LED.A 82.37,68.58 82.37,63.63 86.26,59.74 R39.1 | R38.1 91.29,59.66 90.22,58.6 90.22,58.52 89.99,58.29 87.63,58.29 86.33,59.59 R39.1 | 80.77,30.63 80.77,55.47 76.58,59.66 R41.1 | v75.44,61.34 75.44,60.58 76.12,59.89 R41.1 | ATMEGA2560.81 56.84,67.62 55.88,68.58 v48.26,68.58 | ATMEGA2560.11 42.18,56.88 41.91,57.15 41.91,62.23 | 41.91,62.23 v45.72,66.04 46.99,66.04 47.84,65.19 ATMEGA2560.99 | ATMEGA2560.62 63,55.38 v71.12,63.5 | ATMEGA2560.32 50.34,43.64 50.8,43.18 v52.07,43.18 | 41.91,62.23 40.64,63.5 v19.05,63.5 | v66.04,29.21 78.08,29.21 79.5,30.63
  Bottom 0.305: v17.68,90.14 14.78,90.14 13.26,88.62 9.6,88.62 v9.53,88.54 9.53,74.75 9.14,74.37 v9.14,70.33 17.51,61.96 | v19.66,51.05 19.66,59.82 17.51,61.96 | v58.29,79.63 58.29,75.51 v57.3,74.52 v58.29,73.53 58.37,73.46 63.32,73.46 72.2,64.58 | v75.44,61.34 72.2,64.58 | v71.12,63.5 72.2,64.58 | v45.72,66.04 v48.26,68.58 | v19.05,63.5 17.51,61.96 | v52.07,43.18 v66.04,29.21
+5V2
  Top 0.152: 6.4,14.48 6.4,20.27 JP11.2 | 6.4,14.48 6.4,12.72 BATT2.2 | 6.4,14.48 11.81,14.48 13.56,12.72 13.95,12.72 BATT1.2
AREF
  Top 0.152: ATMEGA2560.98 48.31,63.93 48.31,65.99 27.43,86.87 27.43,91.29 27.2,91.52 22.71,91.52 21.41,90.22 C6.1
GND
  Top 0.152: 20.23,6.21 17.83,3.81 JP4.6 | 20.23,6.21 20.27,6.25 20.27,10.13 SOLAR.1 | JP4.3 24.46,3.81 22.1,6.17 20.27,6.17 20.23,6.21 | JP11.1 3.81,25.38 6.33,27.89 JP8.1 | JP1.3 18.48,95.82 | 18.48,95.82 21.34,92.96 38.1,92.96 LED2.C | 10.4,68.16 12.8,70.56 12.8,73.61 C4.2 | 10.4,68.16 10.36,68.12 7.77,68.12 7.54,68.35 7.54,72.39 7.7,72.54 7.7,73.61 C5.2 7.77,73.69 7.77,85.11 18.48,95.82 | ICSP.6 32.99,41.91 31.62,43.28 31.62,51.44 U1.4 31.55,51.44 31.24,51.74 21.57,51.74 | 21.57,51.74 19.36,51.74 17.83,50.22 17.83,49.53 JP5.6 17.75,49.53 17.75,43.51 6.78,32.54 5.94,32.54 4.19,34.29 JP10.1 | 21.57,51.74 21.57,54.71 10.44,65.84 10.44,68.12 10.4,68.16 | JP3.3 85.09,6.3 78.42,12.97 | 78.42,12.97 64.92,26.47 U$1.10 | FTDI1.1 99.06,33.6 78.42,12.97
  Bottom 0.152: JP10.1 3.81,30.48 JP8.1 | SOLAR.1 20.27,10.21 18.67,10.21 10.36,18.52 5.56,18.52 3.81,20.27 JP11.1 | JP6.2 83.82,96.55 84.66,96.55 85.88,97.77 89.38,97.77 90.22,96.93 90.22,71.4 100.2,61.42 100.2,49.45 99.06,48.31 FTDI1.1 | ICSP.6 48.9,41.91 U$1.10
L13
  Top 0.152: IC7.1 41,38.56 41.53,38.56 IC7.2 41.6,38.48 41.6,38.02 41.99,37.64 63.78,37.64 65.08,38.94 65.08,40.46 65.53,40.92 69.72,40.92 71.25,39.4 R10.2
MISO  (via drill 0.35)
  Top 0.152: v38.33,51.44 45.34,51.44 ATMEGA2560.22 | v33.53,52.27 31.85,53.95 31.62,53.95 U1.2
  Bottom 0.152: 33.8,52.01 28.96,47.17 28.96,40.39 ICSP.1 | 33.8,52.01 33.91,52.12 35.89,52.12 36.58,51.44 v38.33,51.44 38.94,52.05 47.85,52.05 80.01,19.89 JP3.5 | 33.8,52.01 v33.53,52.27
MOSI  (via drill 0.35)
  Top 0.152: ATMEGA2560.21 45.34,51.89 38.79,51.89 38.63,52.05 37.64,52.05 37.03,51.44 U1.5 37.03,51.51 v35.59,51.51
  Bottom 0.152: ICSP.4 30.48,48.23 34.06,51.82 35.28,51.82 v35.59,51.51 44.88,42.22 49.92,42.22 65.47,26.67 66.04,26.67 73.53,19.18 73.53,13.56 73.53,12.7 73.53,3.58 74.45,2.67 75.44,2.67 76.58,3.81 JP3.6
N$1
  Top 0.152: 5V_ON_LED1.A 3.81,36.8 6.33,34.29 JP10.2
N$2  (via drill 0.35)
  Top 0.152: R1.1 41.3,91.44 42.29,92.43 v44.2,92.43
  Bottom 0.152: v44.2,92.43 67.59,92.43 FTDI1.6
N$3
  Top 0.152: JP4.1 21.64,12.65 20.34,12.65 SOLAR.2
N$6  (via drill 0.35)
  Top 0.152: v72.62,56.84 72.62,37.95 75.59,34.98 75.59,31.01 75.36,30.79 73.99,30.79 73.08,31.7 70.87,31.7 R4.2 | v44.73,84.73 43.28,84.73 38.1,89.92 LED2.A
  Bottom 0.152: v44.73,84.73 v72.62,56.84
N$7
  Top 0.152: L.A 74.68,31.77 74.68,33.15 68.5,39.32 R10.1
N$13
  Top 0.152: PWRIN_ON_LED.C 77.72,68.58 77.72,65.91 83.9,59.74 R40.2
N$14
  Top 0.152: USB_POWER_ON_LED.C 94.18,68.58 94.18,61.95 92.43,60.2 92.43,58.6 91.67,57.84 80.77,57.84 78.94,59.66 R41.2
N$20
  Top 0.152: PWRIN_REV_LED.C 84.05,68.58 83.06,69.57 77.04,69.57 75.59,68.12 75.59,62.48 73.84,60.73 73.84,59.74 R54.2
N$22
  Top 0.152: U$31.3 10.06,69.11 10.06,70.03 11.73,71.7 11.73,74.6 17.22,80.09 23.16,80.09 26.36,83.29 26.36,90.14 C23.1
N$23  (via drill 0.35)
  Top 0.152: v21.95,80.7 17.37,80.7 11.43,74.75 11.43,71.86 10.36,70.79 9.68,70.79 9.07,71.4 9.07,71.63 U$31.5 | v28.96,87.71 29.11,87.71 31.55,90.14 C22.1
  Bottom 0.152: v28.96,87.71 v21.95,80.7
N$26  (via drill 0.35)
  Top 0.152: v20.95,54.41 16.61,50.06 16.61,49.3 10.74,43.43 3.81,43.43 5V_ON_LED1.C | v29.79,85.42 34.52,90.14 C22.2 | 5V_REV_LED1.C 70.94,68.58 v69.04,66.67
  Bottom 0.152: v20.95,54.41 20.95,76.58 v29.79,85.42 29.79,85.34 45.03,85.34 63.7,66.67 v69.04,66.67
N$37  (via drill 0.35)
  Top 0.152: v57.68,91.14 57.53,90.98 57.53,79.4 57.99,78.94 58.06,78.94 65,72.01 3V3_REV_LED.C | v20.95,87.71 19.28,87.71 14.17,82.6 R36.2
  Bottom 0.152: v57.68,91.14 24.38,91.14 v20.95,87.71
N$48
  Top 0.152: 5V_ON_LED.C 82.83,31.77 82.83,54.56 85.8,57.53 91.97,57.53 94.11,59.66 R38.2
N$71
  Top 0.152: R4.1 68.89,31.7 56.79,31.7 44.31,19.21 U$1.15
N$110  (via drill 0.35)
  Top 0.152: v84.05,54.86 89.08,49.84 89.08,31.77 5V_REV_LED.C | v23.47,81.31 13.18,81.31 12.42,82.07 12.42,83.67 12.19,83.9 10.36,83.9 9.07,82.6 R37.2
  Bottom 0.152: v84.05,54.86 52.88,86.03 28.19,86.03 v23.47,81.31
N$120
  Top 0.152: 3V3_ON_LED.C 95.48,31.77 95.48,68.96 94.87,69.57 93.57,69.57 92.13,68.12 92.13,62.79 89.08,59.74 R39.2
PB0  (via drill 0.35)
  Top 0.152: U1.1 31.62,55.24 32.23,54.63 37.8,54.63 39.55,52.88 ATMEGA2560.19 45.41,52.81 46.18,52.81 v47.55,51.44
  Bottom 0.152: v47.55,51.44 74.91,24.08 74.91,3.81 JP3.7
PB4  (via drill 0.35)
  Top 0.152: v49.3,52.73 48.54,51.97 48.54,51.51 47.85,50.83 45.41,50.83 ATMEGA2560.23 | v65.23,58.98 65.23,64.24 68.58,67.59 69.04,67.59 70.18,68.73 70.18,80.31 86.33,96.47 JP6.3
  Bottom 0.152: v49.3,52.73 58.98,52.73 v65.23,58.98
PB5  (via drill 0.35)
  Top 0.152: v35.66,53.42 33.76,51.51 33.76,50.9 34.21,50.44 45.34,50.44 ATMEGA2560.24 | v63.4,65.15 63.4,65.3 68.05,69.95 68.05,81.53 82.6,96.09 82.6,97 83.67,98.07 94.94,98.07 96.47,96.55 JP6.7
  Bottom 0.152: v35.66,53.42 38.89,53.42 50.62,65.15 v63.4,65.15
PB6  (via drill 0.35)
  Top 0.152: v49.15,51.66 47.4,49.91 45.41,49.91 ATMEGA2560.25 | v96.93,51.66 98.22,51.66 99.06,50.83 FTDI1.2
  Bottom 0.152: v96.93,51.66 v49.15,51.66
PB7
  Top 0.152: IC7.3 42.29,38.56 42.29,41.07 47.32,46.1 47.32,47.85 ATMEGA2560.26
PWRIN
  Top 0.61: PWRIN_ON_LED.A 74.68,68.58 74.68,63.4 71.02,59.74 R54.1
RESET  (via drill 0.35)
  Top 0.152: R1.2 43.51,91.44 44.65,90.3 46.48,90.3 47.32,91.14 47.32,92.43 47.47,92.58 52.58,92.58 53.72,91.44 D4.A 53.87,91.44 v55.02,90.3 | C11.1 59.28,91.44 v58.14,90.3 | RESET.3 28.27,33.38 28.27,25.07 RESET.4 28.35,25.07 30.79,25.07 31.93,23.93 33.53,23.93 33.76,24.16 33.76,38.63 ICSP.5 33.07,39.4 36.01,42.33 | 36.01,42.33 42.6,48.92 49.07,48.92 49.3,48.69 49.3,47.93 ATMEGA2560.30 | 36.01,42.33 41,37.34 63.93,37.34 65.91,39.32 66.14,39.32 R11.2 66.22,39.4 67.44,40.62 69.34,40.62 69.49,40.46 69.49,38.94 70.33,38.1 72.16,38.1 72.31,38.25 72.31,40.46 69.88,42.9 69.88,60.81 72.62,63.55 v72.62,67.21
  Bottom 0.152: v55.02,90.3 v58.14,90.3 62.26,90.3 72.62,79.93 v72.62,67.21
RXD2  (via drill 0.35)
  Top 0.152: v66.45,62.03 93.95,89.53 93.95,96.47 JP6.6 | ATMEGA2560.12 45.22,56.26 44.49,56.26 44.12,55.88 43.18,55.88 42.93,55.63 v42.93,55.35
  Bottom 0.152: v66.45,62.03 60.55,56.13 43.71,56.13 v42.93,55.35
RXD3
  Top 0.152: JP1.5 14.17,97.99 50.06,97.99 57.07,90.98 57.07,79.4 57.84,78.64 57.91,78.64 63.25,73.3 63.25,67.67 62.79,67.21 62.79,56.54 62.18,55.93 61.34,55.93 ATMEGA2560.63
SCK  (via drill 0.35)
  Top 0.152: ATMEGA2560.20 45.34,52.43 37.26,52.43 37.03,52.65 U1.6 36.96,52.65 35.81,52.65 v34.37,51.21
  Bottom 0.152: v34.37,51.21 32,48.84 32,41.99 30.48,40.46 ICSP.3 31.75,40.64 34.29,40.64 35.56,39.37 41.91,39.37 63.87,17.41 64.73,17.41 66.04,16.1 66.04,7.95 72.39,1.6 79.4,1.6 81.61,3.81 JP3.4
SCL
  Top 0.152: ATMEGA2560.43 55.85,47.85 55.85,39.55 56.01,39.4 R13.2
SDA
  Top 0.152: ATMEGA2560.44 56.39,47.85 56.39,44.04 61.04,39.4 R12.2
TXD2  (via drill 0.35)
  Top 0.152: v65.84,60.5 65.84,64.39 68.73,67.28 69.19,67.28 70.48,68.58 70.48,75.51 91.44,96.47 JP6.5 | 45.41,55.85 ATMEGA2560.13 45.46,55.76 46.19,55.76 46.32,55.62 46.32,54.9 46.71,54.51 v47.02,54.51
  Bottom 0.152: v47.02,54.51 59.84,54.51 v65.84,60.5
TXD3
  Top 0.152: ATMEGA2560.64 62.1,56.39 62.48,56.77 62.48,67.36 62.94,67.82 62.94,73.15 57.76,78.33 57.68,78.33 56.77,79.25 56.77,90.83 49.91,97.69 16.38,97.69 15.24,96.55 JP1.4
XTAL1
  Top 0.152: Y1.3 58.14,74.37 57.61,73.84 57.61,73.23 60.05,70.79 60.05,62.87 51.36,54.18 51.36,47.93 ATMEGA2560.34 | R5.1 45.87,91.44 47.32,92.89 54.25,92.89 56.46,90.68 56.46,78.64 58.14,76.96 Y1.3 | Y1.3
XTAL2
  Top 0.152: ATMEGA2560.33 50.9,47.93 50.9,54.18 59.74,63.02 59.74,70.64 56.16,74.22 Y1.1 56.08,76.2 48.46,83.82 48.46,91.44 R5.2